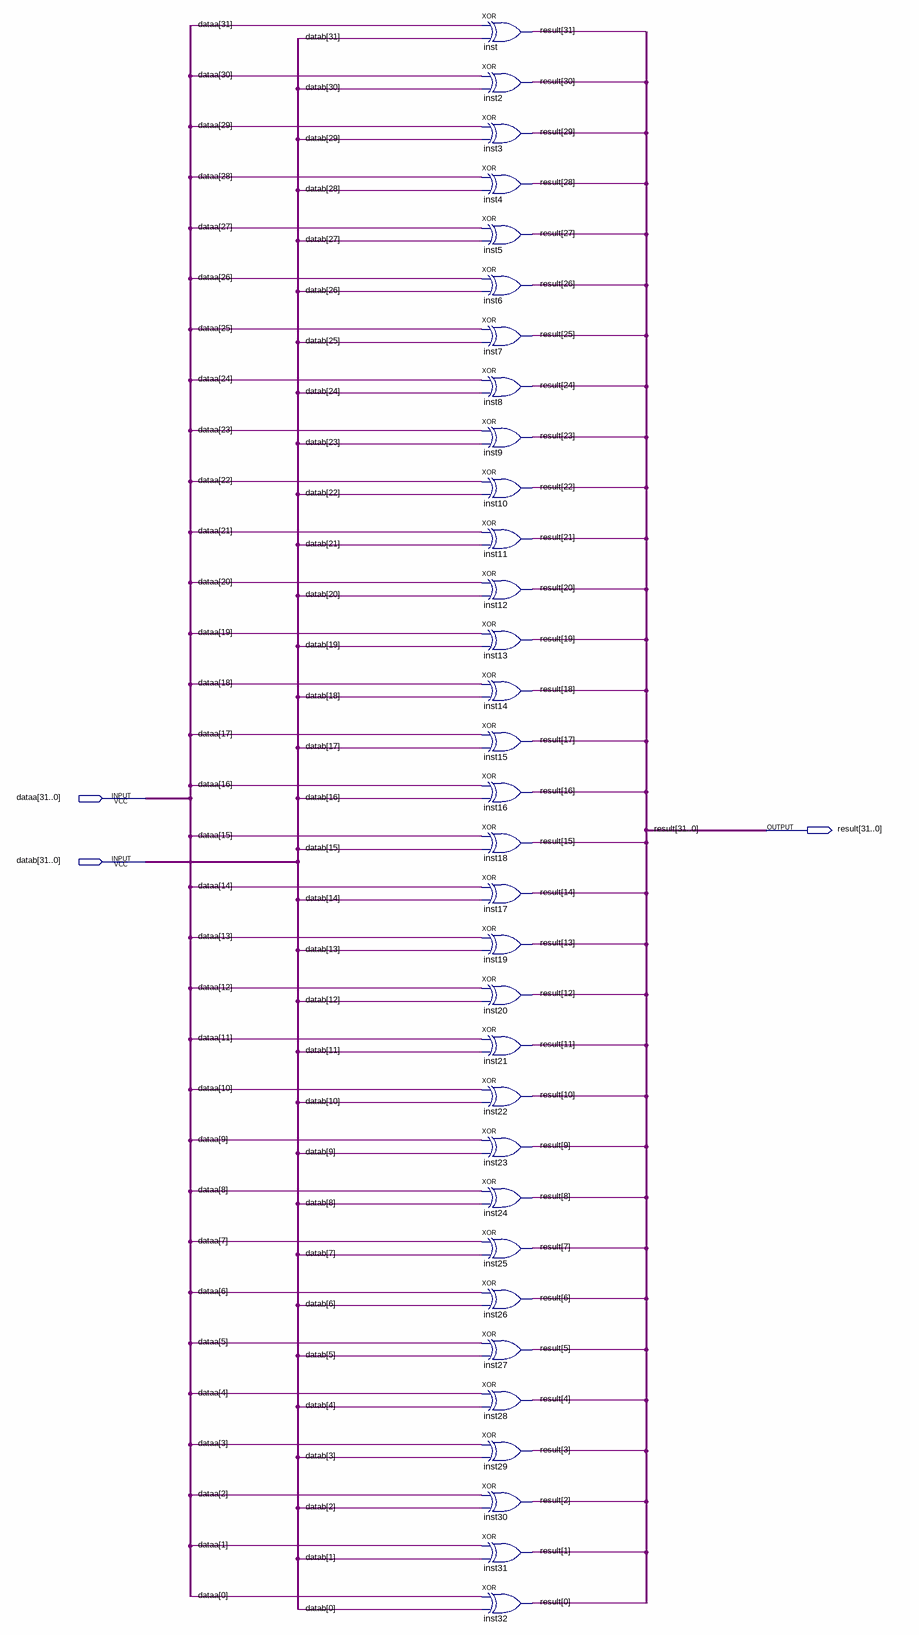
[diagram p0: schematic sheet]
// Quartus schematic ula_xor.bdf as structural Verilog: 32 symbols, 3 pins
module ula_xor (
  input  [31:0] dataa,
  input  [31:0] datab,
  output [31:0] result
);

  xor inst (result[31], dataa[31], datab[31]);
  xor inst2 (result[30], dataa[30], datab[30]);
  xor inst3 (result[29], dataa[29], datab[29]);
  xor inst4 (result[28], dataa[28], datab[28]);
  xor inst5 (result[27], dataa[27], datab[27]);
  xor inst6 (result[26], dataa[26], datab[26]);
  xor inst7 (result[25], dataa[25], datab[25]);
  xor inst8 (result[24], dataa[24], datab[24]);
  xor inst9 (result[23], dataa[23], datab[23]);
  xor inst10 (result[22], dataa[22], datab[22]);
  xor inst11 (result[21], dataa[21], datab[21]);
  xor inst12 (result[20], dataa[20], datab[20]);
  xor inst13 (result[19], dataa[19], datab[19]);
  xor inst14 (result[18], dataa[18], datab[18]);
  xor inst15 (result[17], dataa[17], datab[17]);
  xor inst16 (result[16], dataa[16], datab[16]);
  xor inst18 (result[15], dataa[15], datab[15]);
  xor inst17 (result[14], dataa[14], datab[14]);
  xor inst19 (result[13], dataa[13], datab[13]);
  xor inst20 (result[12], dataa[12], datab[12]);
  xor inst21 (result[11], dataa[11], datab[11]);
  xor inst22 (result[10], dataa[10], datab[10]);
  xor inst23 (result[9], dataa[9], datab[9]);
  xor inst24 (result[8], dataa[8], datab[8]);
  xor inst25 (result[7], dataa[7], datab[7]);
  xor inst26 (result[6], dataa[6], datab[6]);
  xor inst27 (result[5], dataa[5], datab[5]);
  xor inst28 (result[4], dataa[4], datab[4]);
  xor inst29 (result[3], dataa[3], datab[3]);
  xor inst30 (result[2], dataa[2], datab[2]);
  xor inst31 (result[1], dataa[1], datab[1]);
  xor inst32 (result[0], dataa[0], datab[0]);
endmodule
